# Altium schematic sheet Main.SchDoc: Main
size A4; CompanyName: -; DrawnBy: Naldi, López; Revision: 1; SheetNumber: 1; SheetTotal: 2; Number: 25
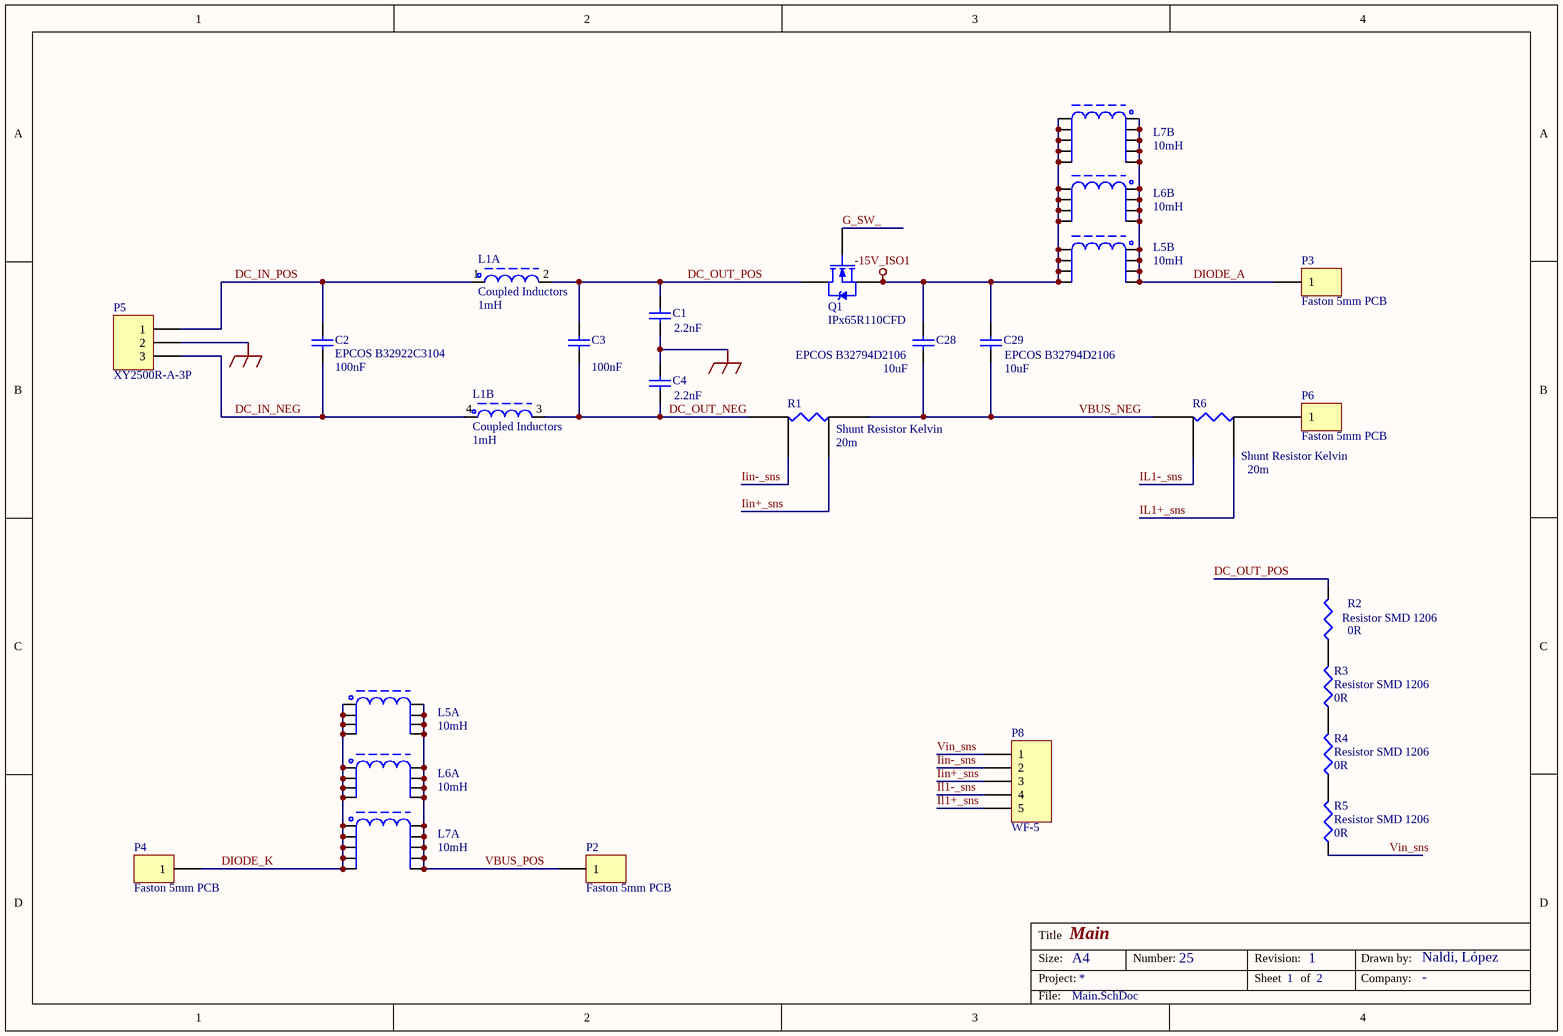
[diagram p0: Main.SchDoc]

## Parts
C1  value 2.2nF  [SAFETY Y1 type]  (hidden comment: TDK CD12-E2GA222MYNS)
C2  EPCOS B32922C3104  value 100nF  [MKP PITCH:15mm SIZE:5mmx18mm]
C3  value 100nF  [MKP PITCH:15mm SIZE:5mmx18mm]  (hidden comment: EPCOS B32922C3104)
C4  value 2.2nF  [SAFETY Y1 type]  (hidden comment: TDK CD12-E2GA222MYNS)
C28  EPCOS B32794D2106  value 10uF  [MKP AC filtering - 10]
C29  EPCOS B32794D2106  value 10uF  [MKP AC filtering - 10]
L1  Coupled Inductors  value 1mH  [Bourns 8108-RC]  (parts A,B of 2)
L5  value 10mH  [Core_PM_62/49]  (hidden comment: Coupled Inductors)  (parts A,B of 2)
L6  value 10mH  [Core_PM_74/59]  (hidden comment: Coupled Inductors)  (parts A,B of 2)
L7  value 10mH  [Core_PM_87/70]  (hidden comment: Coupled Inductors)  (parts A,B of 2)
P2  Faston 5mm PCB  [FASTON 5mm PCB]
P3  Faston 5mm PCB  [FASTON 5mm PCB]
P4  Faston 5mm PCB  [FASTON 5mm PCB]
P5  XY2500R-A-3P  [XY2500R-A-3P]
P6  Faston 5mm PCB  [FASTON 5mm PCB]
P8  WF-5  [HDR1X5]
Q1  IPx65R110CFD  [TO-247 Horiz. Heatsink]
R1  Shunt Resistor Kelvin  value 20m  [Chip2PinSM127P600-8N]
R2  Resistor SMD 1206  value 0R  [RESC3116X07N - 1206]
R3  Resistor SMD 1206  value 0R  [RESC3116X07N - 1206]
R4  Resistor SMD 1206  value 0R  [RESC3116X07N - 1206]
R5  Resistor SMD 1206  value 0R  [RESC3116X07N - 1206]
R6  Shunt Resistor Kelvin  value 20m  [Chip2PinSM127P600-8N]

## Nets
-15V_ISO1: C28.2 C29.2 L5.5 L5.6 L5.7 L5.8 L6.6 L6.7 L6.8 L6.9 L7.6 L7.7 L7.8 L7.9 L7.10 Q1.3(S)
EARTH: C1.1 C4.2 P5.2
DC_IN_NEG: C2.1 L1.4 P5.3
DC_IN_POS: C2.2 L1.1 P5.1
DC_OUT_NEG: C3.1 C4.1 L1.3 R1.4
DC_OUT_POS: C1.2 C3.2 L1.2 Q1.2(D) R2.2
DIODE_A: L5.9 L5.10 L5.11 L5.12 L6.10 L6.11 L6.12 L6.13 L7.11 L7.12 L7.13 L7.14 L7.15 P3.1
DIODE_K: L5.1 L5.2 L5.3 L5.4 L6.1 L6.2 L6.3 L6.4 L7.1 L7.2 L7.3 L7.4 L7.5 P4.1
G_SW_: Q1.1(G)
Iin+_sns: P8.3 R1.2
Iin-_sns: P8.2 R1.3
IL1+_sns: P8.5 R6.2
IL1-_sns: P8.4 R6.3
VBUS_NEG: C28.1 C29.1 R1.1 R6.4
VBUS_POS: L5.13 L5.14 L5.15 L5.16 L6.15 L6.16 L6.17 L6.18 L7.16 L7.17 L7.18 L7.19 L7.20 P2.1
Vin_sns: P8.1 R5.1
NetP6_1: P6.1 R6.1
NetR2_1: R2.1 R3.2
NetR3_1: R3.1 R4.2
NetR4_1: R4.1 R5.2

## Notes on the sheet
- Title
- Size:
- Project:
- A4
- Number:
- Revision:
- Sheet
- of
- Drawn by:
- Company:
- File:

## Library data of the parts
C1 C4 = TDK CD12-E2GA222MYNS: Safety Standard Certified Ceramic Y1 2.2nF 250Vac; Published: 8-Jun-2000; LatestRevisionDate: 17-Jul-2002; LatestRevisionNote: Re-released for DXP Platform.; PackageReference: RAD-0.3; Publisher: Altium Limited; PackageDescription: Radial Cap, Thru-Hole; 2 Leads; 0.3 in Pin Spacing
C2 C3 = EPCOS B32922C3104: MKP EMI suppression X2 100nF 305Vac; Published: 8-Jun-2000; LatestRevisionDate: 17-Jul-2002; LatestRevisionNote: Re-released for DXP Platform.; PackageReference: RAD-0.3; Publisher: Altium Limited; PackageDescription: Radial Cap, Thru-Hole; 2 Leads; 0.3 in Pin Spacing
C28 C29 = EPCOS B32794D2106: MKP AC Filtering 10uF 630Vdc; Published: 8-Jun-2000; LatestRevisionDate: 17-Jul-2002; LatestRevisionNote: Re-released for DXP Platform.; PackageReference: RAD-0.3; Publisher: Altium Limited; PackageDescription: Radial Cap, Thru-Hole; 2 Leads; 0.3 in Pin Spacing
L1 = Common mode filter 10A: Bourns Common mode inductor 10A 1mH 8108-RC; Code_IEC: 1005; Published: 8-Jun-2000; LatestRevisionDate: 29-May-2009; LatestRevisionNote: IPC-7351 Footprint Added.; PackageReference: 0402-A; Publisher: Altium Limited; PackageDescription: Chip Inductor; Code_JEITA: 0402
L5 = Inductor 62/49: Coupled Inductors with Ferrite core and Air gap; Code_IEC: 1005; Published: 8-Jun-2000; LatestRevisionDate: 29-May-2009; LatestRevisionNote: IPC-7351 Footprint Added.; PackageReference: 0402-A; Publisher: Altium Limited; PackageDescription: Chip Inductor; Code_JEITA: 0402
L6 = Inductor 74/59: Coupled Inductors with Ferrite core and Air gap; Code_IEC: 1005; Published: 8-Jun-2000; LatestRevisionDate: 29-May-2009; LatestRevisionNote: IPC-7351 Footprint Added.; PackageReference: 0402-A; Publisher: Altium Limited; PackageDescription: Chip Inductor; Code_JEITA: 0402
L7 = Inductor 87/70: Coupled Inductors with Ferrite core and Air gap; Code_IEC: 1005; Published: 8-Jun-2000; LatestRevisionDate: 29-May-2009; LatestRevisionNote: IPC-7351 Footprint Added.; PackageReference: 0402-A; Publisher: Altium Limited; PackageDescription: Chip Inductor; Code_JEITA: 0402
P2-P4 P6 = Faston 5mm PCB: System: Connector; LatestRevisionDate: 17-Jul-2002; LatestRevisionNote: Re-released for DXP Platform.; Publisher: Altium Limited
P5 = XY2500R-A-3P: HEADER 3P 90gra P/CI P=5MM; System: Connector; LatestRevisionDate: 17-Jul-2002; LatestRevisionNote: Re-released for DXP Platform.; Publisher: Altium Limited
P8 = Header 5: Header, 5-Pin, 2.54mm pitch; System: Connector; LatestRevisionDate: 17-Jul-2002; LatestRevisionNote: Re-released for DXP Platform.; Publisher: Altium Limited
Q1 = IPx65R110CFD: Infineon Power MOSFET N-Channel 650V 31.2A; Published: 17-Sep-2003; DatasheetVersion: 13-Jul-2001; PackageVersion: 16-Sep-2002; PackageReference: SMD-0.5; Publisher: Altium Limited; PackageDescription: SM; 3 Leadless Terminals; Body 10.28 x 7.64 x 3.06 mm (LxWxH); ComponentLink1Description: Manufacturer Link; ComponentLink1URL: http://www.irf.com/; ComponentLink2Description: Datasheet; ComponentLink2URL: http://www.irf.com/product-info/datasheets/data/IRHN7150.pdf
R1 R6 = Shunt Resistor Kelvin: Published: 8-Jun-2000; LatestRevisionDate: 29-May-2009; LatestRevisionNote: IPC-7351 Footprint Added.; PackageReference: J1-0603; Publisher: Altium Limited; PackageDescription: Chip Resistor
R2-R5 = Resistor SMD 1206: Published: 8-Jun-2000; LatestRevisionDate: 29-May-2009; LatestRevisionNote: IPC-7351 Footprint Added.; PackageReference: J1-0603; Publisher: Altium Limited; PackageDescription: Chip Resistor